# Altium project PCB_NHUNG.PrjPcb
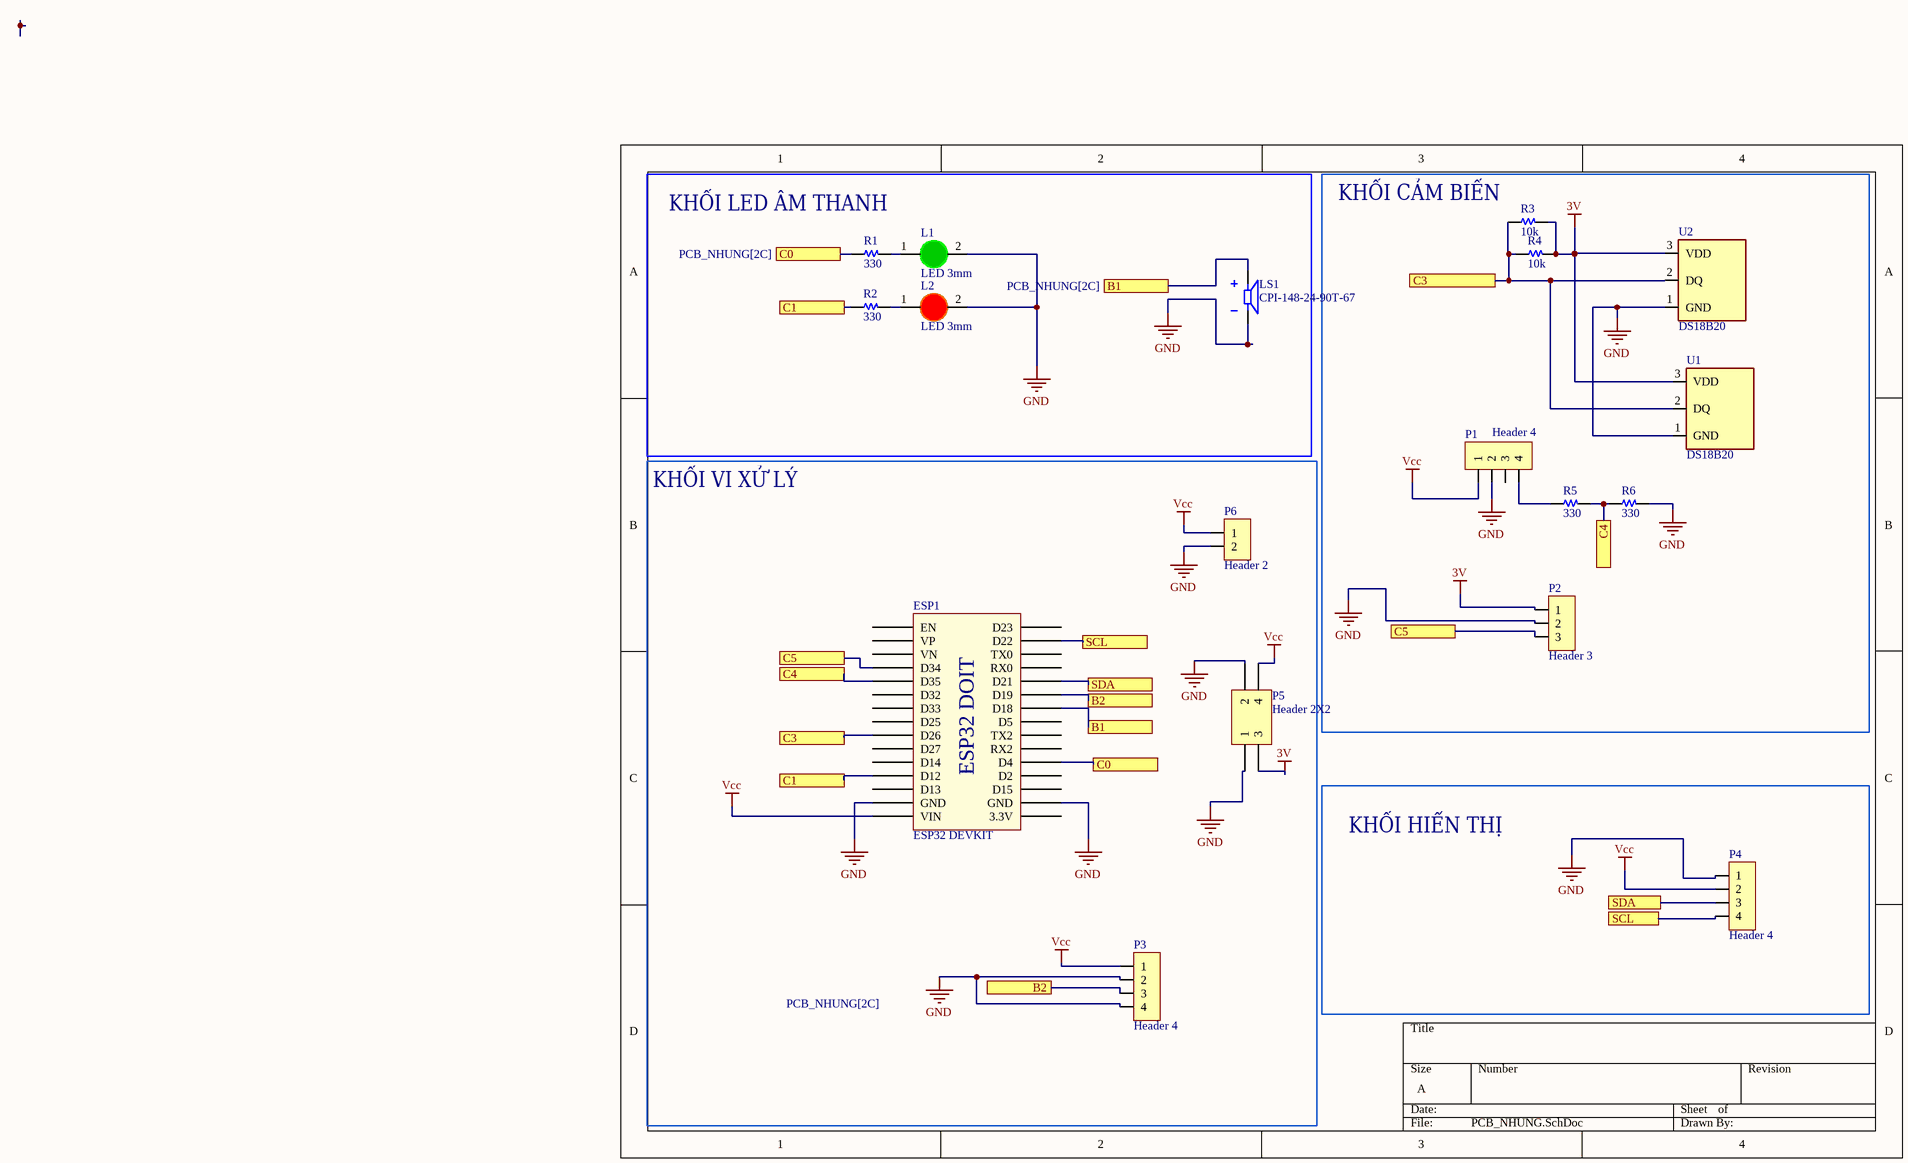
[diagram p0: PCB_NHUNG.SchDoc]
1 sheet, 18 parts. Net scope: flat (ports and power ports of the same name join across sheets).
Board file: PCB_NHUNG.PcbDoc

## Sheet PCB_NHUNG.SchDoc
size A; SheetNumber: 1; SheetTotal: 1

### Parts
ESP1  ESP32 DEVKIT  [ESP32 WROOM 32 KIT]
L1  LED 3mm  [LED-3MM-GREEN]
L2  LED 3mm  [LED-3MM-RED]
LS1  CPI-148-24-90T-67  [XDCR_CPI-148-24-90T-67]
P1  Header 4  [HDR/Header/4/2mm]
P2  Header 3  [HDR/Header/3/2mm]
P3  Header 4  [HDR/Header/4/2mm]
P4  Header 4  [HDR/Header/4/2mm]
P5  Header 2X2  [HDR2X2]
P6  Header 2  [HDR/Header/2/2mm]
R1  330  [R 1/4W/300]
R2  330  [R 1/4W/300]
R3  10k  [R 1/4W/300]
R4  10k  [R 1/4W/300]
R5  330  [R 1/4W/300]
R6  330  [R 1/4W/300]
U1  DS18B20  [TO-92-AMMO]
U2  DS18B20  [TO-92-AMMO]

### Blocks framed on the sheet
KHỐI LED ÂM THANH: L1 L2 LS1 R1 R2
KHỐI CẢM BIẾN: P1 P2 R3-R6 U1 U2
KHỐI VI XỬ LÝ: ESP1 P3 P5 P6
KHỐI HIỂN THỊ: P4

### Ports
B1 (see PCB_NHUNG[2A]), B1 (see PCB_NHUNG[2C]), B2 (see PCB_NHUNG[2C]), B2 (see PCB_NHUNG[2D]), C0 (see PCB_NHUNG[1A]), C0 (see PCB_NHUNG[2C]), C1 (see PCB_NHUNG[1A]), C1 (see PCB_NHUNG[1C]), C3 (see PCB_NHUNG[1C]), C3 (see PCB_NHUNG[3A]), C4 (see PCB_NHUNG[1C]), C4 (see PCB_NHUNG[4B]), C5 (see PCB_NHUNG[1C]), C5 (see PCB_NHUNG[3B]), SCL (see PCB_NHUNG[2B]), SCL (see PCB_NHUNG[4D]), SDA (see PCB_NHUNG[2C]), SDA (see PCB_NHUNG[4C])

### Nets
3V: P2.1 P5.3 R3.2 R4.2 U1.3(VDD) U2.3(VDD)
GND: ESP1.14(GND) ESP1.17(GND) L1.2(K) L2.2(K) LS1.N P1.2 P2.2 P3.2 P3.4 P4.1 P5.1 P5.2 P6.2 R6.2 U1.1(GND) U2.1(GND)
Vcc: ESP1.15(VIN) P1.1 P3.1 P4.2 P5.4 P6.1
NetESP1_4: ESP1.4(D34) P2.3 ; port C5
NetESP1_5: ESP1.5(D35) R5.2 R6.1 ; port C4
NetESP1_9: ESP1.9(D26) R3.1 R4.1 U1.2(DQ) U2.2(DQ) ; port C3
NetESP1_12: ESP1.12(D12) R2.1 ; port C1
NetESP1_20: ESP1.20(D4) R1.1 ; port C0
NetESP1_24: ESP1.24(D18) LS1.P ; port B1
NetESP1_25: ESP1.25(D19) P3.3 ; port B2
NetESP1_26: ESP1.26(D21) P4.3 ; port SDA
NetESP1_29: ESP1.29(D22) P4.4 ; port SCL
NetL1_1: L1.1(A) R1.2
NetL2_1: L2.1(A) R2.2
NetP1_4: P1.4 R5.1

Not connected (* = marked no-connect by the designer): ESP1 1(EN) 2(VP) 3(VN) 6(D32) 7(D33) 8(D25) 10(D27) 11(D14) 13(D13) 16(3.3V) 18(D15) 19(D2) 21(RX2) 22(TX2) 23(D5) 27(RX0) 28(TX0) 30(D23); P1 3

### Notes on the sheet
- (in symbol ESP32 WROOM 32 KIT) ESP32 DOIT

### Library data of the parts
ESP1 = ESP32 WROOM 32 KIT
L1 = LED 3mm Xanh La: Cắm; Don_Vi: Con; Ma_Hang: MH001054; Ten_Linh_Kien: Led 3MM Phủ Xanh (10c); Ghi_Chu: *; Kieu_Chan: *; Chung_Loai: Cắm
L2 = LED 3mm Do: Cắm; Don_Vi: Con; Ma_Hang: MH003892; Ten_Linh_Kien: Led 3MM Phủ Đỏ (10c); Ghi_Chu: *; Kieu_Chan: *; Chung_Loai: Cắm
LS1 = CPI-148-24-90T-67: 13,9 Ð¼Ð¼, 24 Ð’ Ð¿Ð¾ÑÑ‚. Ñ‚Ð¾ÐºÐ°, 90 Ð´Ð‘, ÑÐºÐ²Ð¾Ð·Ð½Ð¾Ðµ Ð¾Ñ‚Ð²ÐµÑ€ÑÑ‚Ð¸Ðµ, Ð¿ÑŒÐµÐ·Ð¾ÑÐ»ÐµÐºÑ‚Ñ€Ð¸Ñ‡ÐµÑÐºÐ¸Ð¹ Ð·Ð²ÑƒÐºÐ¾Ð²Ð¾Ð¹ Ð¸Ð½Ð´Ð¸ÐºÐ°Ñ‚Ð¾Ñ€; MF: Same Sky; SnapEDA_Link: https://www.snapeda.com/parts/CPI-148-24-90T-67/Same+Sky/view-part/?ref=snap; Package: None; Value: *; MP: CPI-148-24-90T-67; Check_prices: https://www.snapeda.com/parts/CPI-148-24-90T-67/Same+Sky/view-part/?ref=eda
P1 P3 P4 = Header 4: Header, 4-Pin
P2 = Header 3: Header, 3-Pin
P5 = Header 2X2: Header, 2-Pin, Dual row; LatestRevisionDate: 17-Jul-2002; LatestRevisionNote: Re-released for DXP Platform.; Publisher: Altium Limited
P6 = Header 2: Header, 2-Pin
R1-R6 = Resistor
U1 U2 = DS18B20: Temperature Sensor Digital, Local -55Â°C ~ 125Â°C 12 b 8-uMAX/uSOP; MF: Analog Devices; SnapEDA_Link: https://www.snapeda.com/parts/DS18B20/Analog+Devices/view-part/?ref=snap; Package: TO-92-3 Maxim; Value: *; MP: DS18B20; Check_prices: https://www.snapeda.com/parts/DS18B20/Analog+Devices/view-part/?ref=eda